# Altium schematic sheet Sheet1.SchDoc
size A4
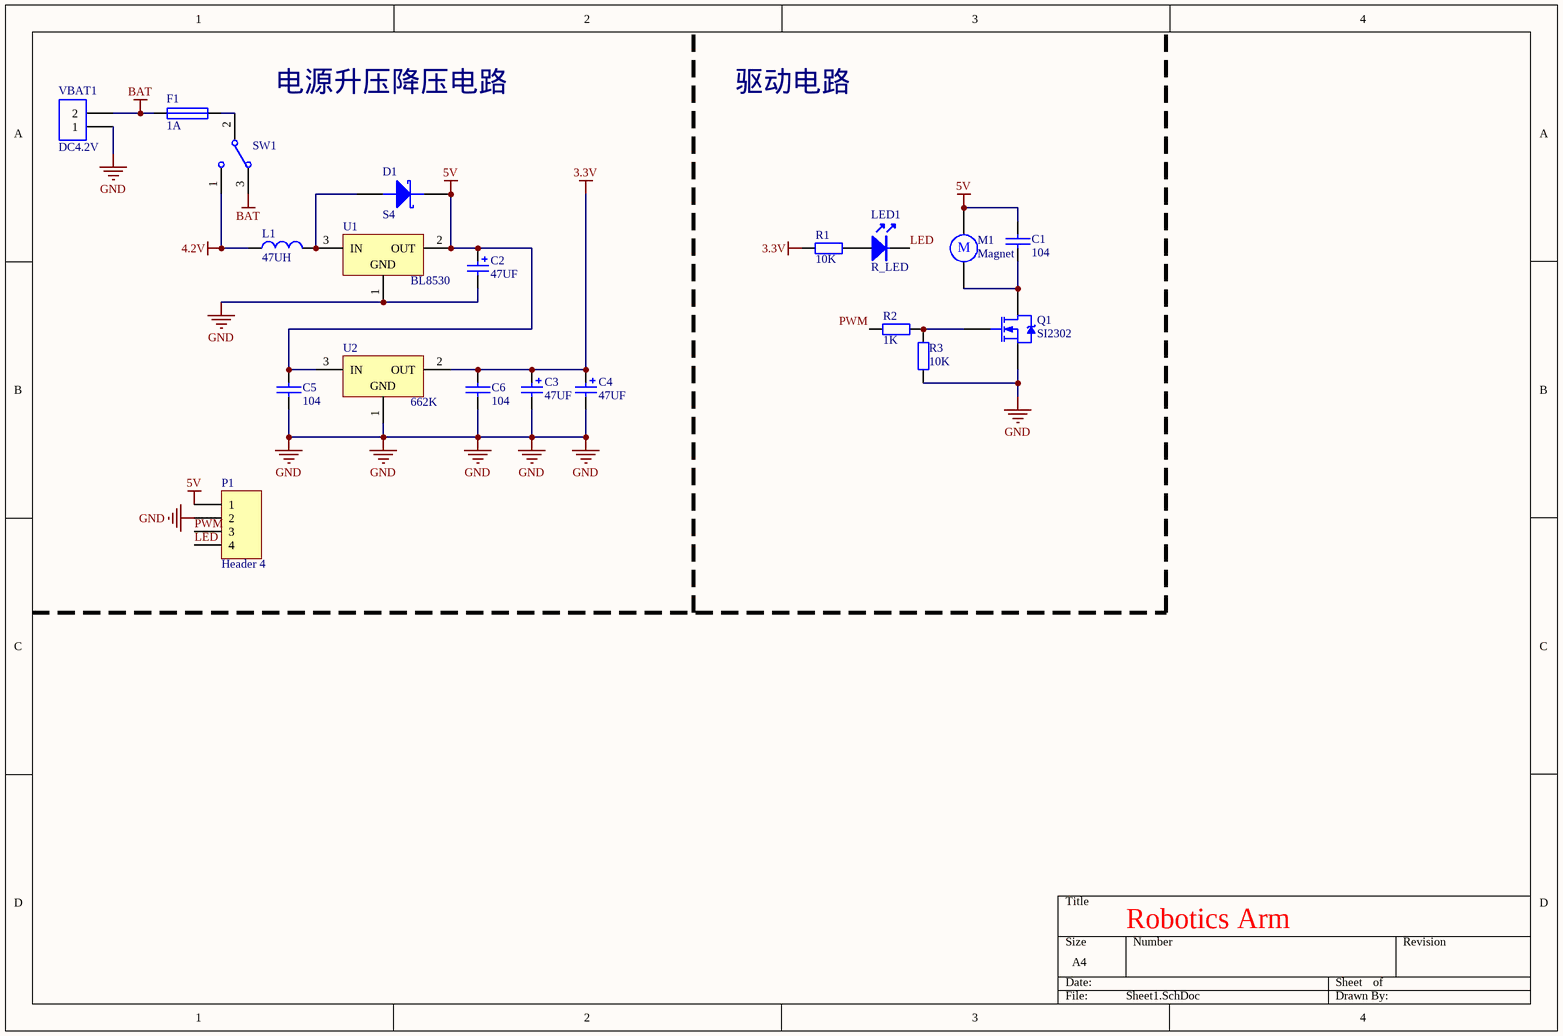
[diagram p0: Sheet1.SchDoc]

## Parts
C1  104  [C_0603]
C2  47UF  [1206]
C3  47UF  [1206]
C4  47UF  [1206]
C5  104  [C_0603]
C6  104  [C_0603]
D1  S4  [SOD-123]
F1  1A  [C1206]
L1  value 47UH  [L_1210]  (hidden comment: Inductor Chip)
LED1  R_LED  [LED-0603]
M1  Magnet  [MOTOR]
P1  Header 4  [HDR1X4]
Q1  SI2302  [SOT-23(SOT-23-3)]
R1  10K  [R_0603]
R2  1K  [R_0603]
R3  10K  [R_0603]
SW1  SW-SPDT  [SWITCH_PWR]  (value not drawn)
U1  BL8530  [SOT-89(SOT-89-3)]
U2  662K  [SOT-23(SOT-23-3)]
VBAT1  DC4.2V  [BAT]

## Nets
3.3V: C3.1 C4.1 C6.1 R1.1 U2.2(OUT)
4.2V: L1.1 SW1.1
5V: C1.2 C2.1 C5.1 D1.2(K) M1.1 P1.1 U1.2(OUT) U2.3(IN)
BAT: F1.2 SW1.3 VBAT1.2
GND: C2.2 C3.2 C4.2 C5.2 C6.2 P1.2 Q1.2(S) R3.1 U1.1(GND) U2.1(GND) VBAT1.1
LED: LED1.2 P1.4
PWM: P1.3 R2.1
NetC1_1: C1.1 M1.2 Q1.3(D)
NetD1_1: D1.1(A) L1.2 U1.3(IN)
NetF1_1: F1.1 SW1.2
NetLED1_1: LED1.1 R1.2
NetQ1_1: Q1.1(G) R2.2 R3.2

## Notes on the sheet
- 电源升压降压电路
- 驱动电路
- Robotics Arm
- (in symbol Motor) M

## Library data of the parts
C1 C5 C6 = CAP: Capacitor
C2-C4 = Cap Pol1: Polarized Capacitor (Radial); pin to pad: 1>2 2>1; Value: 100pF; Published: 8-Jun-2000; LatestRevisionDate: 17-Jul-2002; LatestRevisionNote: Re-released for DXP Platform.; PackageReference: RB7.6-15; Publisher: Altium Limited; PackageDescription: Polarized Capacitor (Radial); 2 Leads
D1 = DIODE SCHOTTKY: Schottky Diode
F1 = FUSE1: Fuse
L1 = Inductor Chip: Inductor; Published: 8-Jun-2000; Revision: July-2002: Re-released for DXP Platform.; Publisher: Altium Limited
LED1 = LED
M1 = Motor: Motor, General Kind; Published: 24-Mar-1999; LatestRevisionDate: 17-Jul-2002; LatestRevisionNote: Re-released for DXP Platform.; PackageReference: RB5-10.5; Publisher: Altium Limited; PackageDescription: Capacitor (Radial); 2 Leads
P1 = Header 4: Header, 4-Pin; LatestRevisionDate: 17-Jul-2002; LatestRevisionNote: Re-released for DXP Platform.; Publisher: Altium Limited
Q1 = SI2302: N沟道MOSFET; Published: 8-August-2017; PackageReference: SOT23-3; Publisher: mazhongwei
R1 R3 = Res2: Resistor; Published: 8-Jun-2000; LatestRevisionDate: 17-Jul-2002; LatestRevisionNote: Re-released for DXP Platform.; Publisher: Altium Limited; Value: 10K
R2 = Res2: Resistor; Value: 10K; Published: 8-Jun-2000; LatestRevisionDate: 17-Jul-2002; LatestRevisionNote: Re-released for DXP Platform.; Publisher: Altium Limited
SW1 = SW-SPDT: SPDT Subminiature Toggle Switch, Right Angle Mounting, Vertical Actuation; Published: 24-Mar-1999; LatestRevisionDate: 17-Dec-2003; LatestRevisionNote: Schematic revised, PCB Footprint replaced.; DatasheetVersion: 05-Dec-2000; PackageReference: TL36WW15050; Publisher: Altium Limited; PackageDescription: Switch; 4 Leads; ComponentLink1Description: Manufacturer Link; ComponentLink1URL: http://www.apem.com
U2 = BL8530
VBAT1 = CON2: Connector; pin to pad: 1>2 2>1